# EAGLE schematic PowerRegulationSchematic (EAGLE 9.6.2)
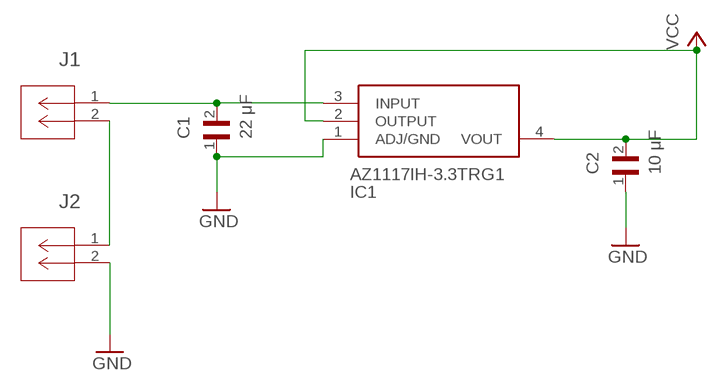
[diagram p0: schematic, sheet 1]

## Parts
C1  22 μF  GRM21BR61A226ME51L  [CAPC2012X140N]
C2  10 μF  GRM21BR71A106KA73L  [CAPC2012X140N]
IC1  AZ1117IH-3.3TRG1  [SOT230P700X170-4N]
J1  B2B-PH-K-S(LF)(SN)  [CONN_B2B-PH-K-S(LF)(SN)_JST]
J2  B2B-PH-K-S(LF)(SN)  [CONN_B2B-PH-K-S(LF)(SN)_JST]

## Nets
GND: C1.1 C2.1 IC1.1(ADJ/GND) J2.2
N$1: J1.2 J2.1
N$2: C1.2 IC1.3(INPUT) J1.1
VCC: C2.2 IC1.2(OUTPUT) IC1.4(VOUT)

## Library data of the parts
C1 = GRM21BR61A226ME51L:GRM21BR61A226ME51L: SMD Capacitor X5R(EIA) with Capacitance: 22uF Tol. 20%. Rated Voltage: 10Vdc; DESCRIPTION: SMD capacitor X5R(EIA) with capacitance 22uF Tol.20%. Rated voltage 10Vdc 85C; DIGI-KEY_PART_NUMBER: 490-10511-1-ND; MF: Murata; MP: GRM21BR61A226ME51L; PACKAGE: 2012 Murata; PURCHASE-URL: https://pricing.snapeda.com/search/part/GRM21BR61A226ME51L/?ref=eda
C2 = GRM21BR71A106KA73L:GRM21BR71A106KA73L: SMD Capacitor X7R(EIA) with Capacitance: 10uF Tol. 10%. Rated Voltage: 10Vdc; DESCRIPTION: SMD capacitor X7R(EIA) with capacitance 10uF Tol.10%. Rated voltage 10Vdc 125C; DIGI-KEY_PART_NUMBER: 490-10516-1-ND; MF: Murata Electronics; MP: GRM21BR71A106KA73L; PACKAGE: 2012 Murata; PURCHASE-URL: https://pricing.snapeda.com/search/part/GRM21BR71A106KA73L/?ref=eda
IC1 = AZ1117IH-3.3TRG1:AZ1117IH-3.3TRG1: LDO Voltage Regulators LDO BJT HiCurr 1.35A 10Hz to 10KHz Source: Datasheet Check prices <https://pricing.snapeda.com/parts/AZ1117IH-3.3TRG1/Diodes%20Inc./view-part?ref=eda>; AVAILABILITY: Warning; DESCRIPTION: Linear Voltage Regulator IC 1 Output 1A SOT-223; MF: Diodes Inc.; MP: AZ1117IH-3.3TRG1; PACKAGE: SOT-223 Diodes Inc.; PRICE: None; PURCHASE-URL: https://pricing.snapeda.com/search/part/AZ1117IH-3.3TRG1/?ref=eda
J1 J2 = 2 Pin JST Connector:B2B-PH-K-S(LF)(SN); BUILT_BY: EMA_Cory; COPYRIGHT: Copyright (C) 2018 Accelerated Designs. All rights reserved; DATASHEET: http://www.jst-mfg.com/product/pdf/eng/ePH.pdf; MANUFACTURER_PART_NUMBER: B2B-PH-K-S(LF)(SN); SOURCELIBRARY: JST_2020-03-20; VENDOR: JST